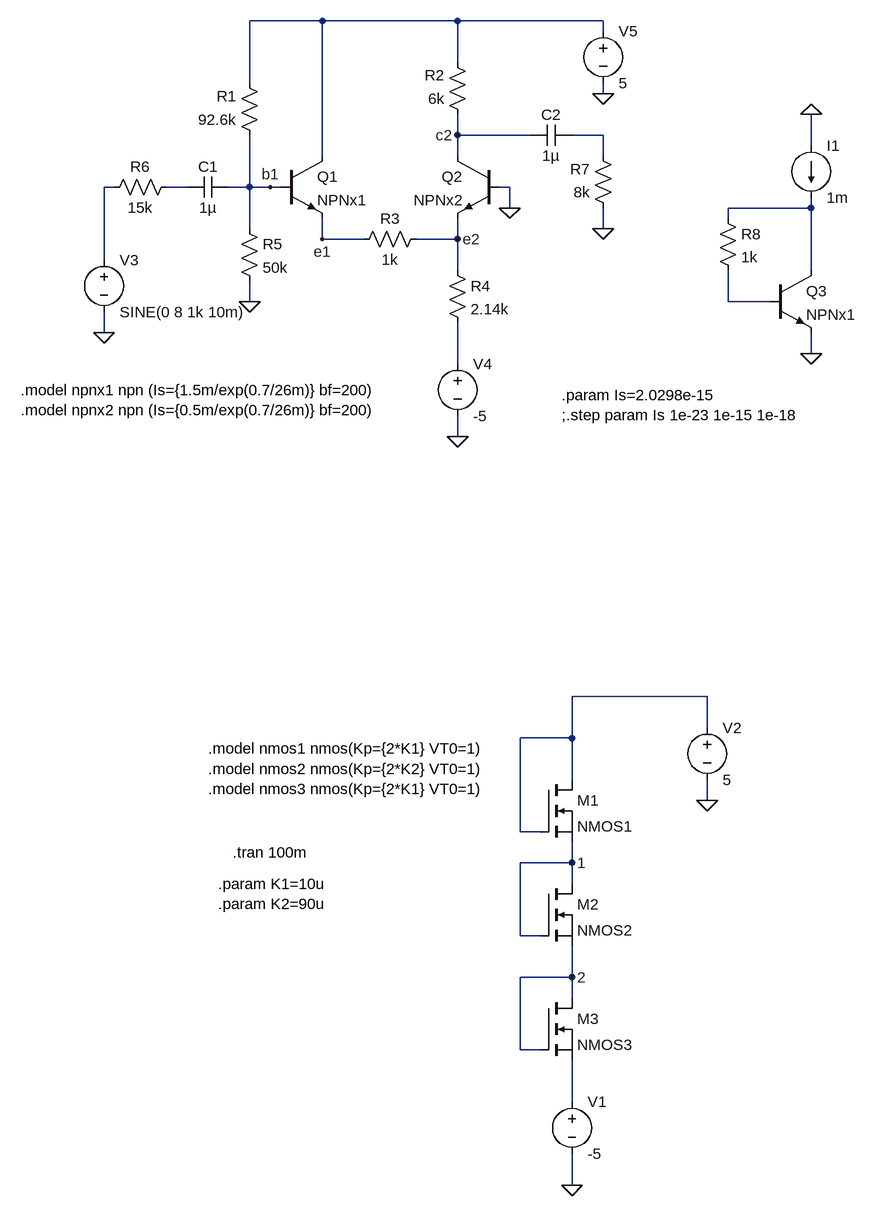
[diagram p0: schematic ss08.asc]
ss08.asc, the LTspice schematic file:
Version 4
SHEET 1 1564 680
WIRE 640 -1168 528 -1168
WIRE 848 -1168 640 -1168
WIRE 1072 -1168 848 -1168
WIRE 1072 -1152 1072 -1168
WIRE 848 -1104 848 -1168
WIRE 528 -1072 528 -1168
WIRE 1072 -1056 1072 -1072
WIRE 848 -992 848 -1024
WIRE 960 -992 848 -992
WIRE 1072 -992 1024 -992
WIRE 1392 -976 1392 -1024
WIRE 640 -960 640 -1168
WIRE 848 -960 848 -992
WIRE 1072 -960 1072 -992
WIRE 320 -912 304 -912
WIRE 432 -912 400 -912
WIRE 528 -912 528 -992
WIRE 528 -912 496 -912
WIRE 560 -912 528 -912
WIRE 576 -912 560 -912
WIRE 928 -912 912 -912
WIRE 928 -880 928 -912
WIRE 1392 -880 1392 -896
WIRE 1392 -880 1264 -880
WIRE 1264 -864 1264 -880
WIRE 528 -848 528 -912
WIRE 1072 -848 1072 -880
WIRE 640 -832 640 -864
WIRE 704 -832 640 -832
WIRE 848 -832 848 -864
WIRE 848 -832 784 -832
WIRE 304 -800 304 -912
WIRE 848 -784 848 -832
WIRE 1392 -784 1392 -880
WIRE 528 -736 528 -768
WIRE 1264 -736 1264 -784
WIRE 1328 -736 1264 -736
WIRE 304 -688 304 -720
WIRE 1392 -656 1392 -688
WIRE 848 -640 848 -704
WIRE 848 -528 848 -560
WIRE 1232 -128 1024 -128
WIRE 1232 -80 1232 -128
WIRE 1024 -64 1024 -128
WIRE 1024 -64 944 -64
WIRE 1024 0 1024 -64
WIRE 1232 32 1232 0
WIRE 944 80 944 -64
WIRE 976 80 944 80
WIRE 1024 128 1024 96
WIRE 1024 128 944 128
WIRE 1024 160 1024 128
WIRE 944 240 944 128
WIRE 976 240 944 240
WIRE 1024 304 1024 256
WIRE 1024 304 944 304
WIRE 1024 336 1024 304
WIRE 944 416 944 304
WIRE 976 416 944 416
WIRE 1024 496 1024 432
WIRE 1024 624 1024 576
FLAG 1024 624 0
FLAG 1232 32 0
FLAG 1024 128 1
FLAG 1024 304 2
FLAG 304 -688 0
FLAG 1072 -848 0
FLAG 528 -736 0
FLAG 848 -528 0
FLAG 1072 -1056 0
FLAG 928 -880 0
FLAG 1392 -656 0
FLAG 1392 -1024 0
FLAG 848 -992 c2
FLAG 640 -832 e1
FLAG 848 -832 e2
FLAG 560 -912 b1
SYMBOL nmos 976 0 R0
SYMATTR InstName M1
SYMATTR Value NMOS1
SYMBOL nmos 976 160 R0
SYMATTR InstName M2
SYMATTR Value NMOS2
SYMBOL nmos 976 336 R0
SYMATTR InstName M3
SYMATTR Value NMOS3
SYMBOL voltage 1024 480 R0
WINDOW 123 0 0 Left 2
WINDOW 39 0 0 Left 2
SYMATTR InstName V1
SYMATTR Value -5
SYMBOL voltage 1232 -96 R0
WINDOW 123 0 0 Left 2
WINDOW 39 0 0 Left 2
SYMATTR InstName V2
SYMATTR Value 5
SYMBOL voltage 304 -816 R0
WINDOW 123 0 0 Left 2
WINDOW 39 0 0 Left 2
SYMATTR InstName V3
SYMATTR Value SINE(0 8 1k 10m)
SYMBOL res 544 -976 R180
WINDOW 0 36 76 Left 2
WINDOW 3 36 40 Left 2
SYMATTR InstName R1
SYMATTR Value 92.6k
SYMBOL res 864 -1008 R180
WINDOW 0 36 76 Left 2
WINDOW 3 36 40 Left 2
SYMATTR InstName R2
SYMATTR Value 6k
SYMBOL res 688 -816 R270
WINDOW 0 32 56 VTop 2
WINDOW 3 0 56 VBottom 2
SYMATTR InstName R3
SYMATTR Value 1k
SYMBOL res 832 -800 R0
SYMATTR InstName R4
SYMATTR Value 2.14k
SYMBOL res 512 -864 R0
SYMATTR InstName R5
SYMATTR Value 50k
SYMBOL res 416 -928 R90
WINDOW 0 0 56 VBottom 2
WINDOW 3 32 56 VTop 2
SYMATTR InstName R6
SYMATTR Value 15k
SYMBOL res 1088 -864 R180
WINDOW 0 36 76 Left 2
WINDOW 3 36 40 Left 2
SYMATTR InstName R7
SYMATTR Value 8k
SYMBOL cap 1024 -1008 R90
WINDOW 0 0 32 VBottom 2
WINDOW 3 32 32 VTop 2
SYMATTR InstName C2
SYMATTR Value 1µ
SYMBOL npn 576 -960 R0
SYMATTR InstName Q1
SYMATTR Value NPNx1
SYMBOL npn 912 -960 M0
SYMATTR InstName Q2
SYMATTR Value NPNx2
SYMBOL voltage 848 -656 R0
WINDOW 123 0 0 Left 2
WINDOW 39 0 0 Left 2
SYMATTR InstName V4
SYMATTR Value -5
SYMBOL voltage 1072 -1168 R0
WINDOW 123 0 0 Left 2
WINDOW 39 0 0 Left 2
SYMATTR InstName V5
SYMATTR Value 5
SYMBOL npn 1328 -784 R0
SYMATTR InstName Q3
SYMATTR Value NPNx1
SYMBOL current 1392 -976 R0
SYMATTR InstName I1
SYMATTR Value 1m
SYMBOL res 1248 -880 R0
SYMATTR InstName R8
SYMATTR Value 1k
SYMBOL cap 496 -928 R90
WINDOW 0 0 32 VBottom 2
WINDOW 3 32 32 VTop 2
SYMATTR InstName C1
SYMATTR Value 1µ
TEXT 464 -48 Left 2 !.model nmos1 nmos(Kp={2*K1} VT0=1)\n.model nmos2 nmos(Kp={2*K2} VT0=1)\n.model nmos3 nmos(Kp={2*K1} VT0=1)
TEXT 502 112 Left 2 !.tran 100m
TEXT 480 160 Left 2 !.param K1=10u\n.param K2=90u
TEXT 176 -600 Left 2 !.model npnx1 npn (Is={1.5m/exp(0.7/26m)} bf=200)\n.model npnx2 npn (Is={0.5m/exp(0.7/26m)} bf=200)
TEXT 1008 -592 Left 2 !.param Is=2.0298e-15\n;.step param Is 1e-23 1e-15 1e-18

The netlist it stands for:
* ss08.asc
M1 N008 N008 1 1 NMOS1
M2 1 1 2 2 NMOS2
M3 2 2 N009 N009 NMOS3
V1 N009 0 -5
V2 N008 0 5
V3 N003 0 SINE(0 8 1k 10m)
R1 b1 N001 92.6k
R2 c2 N001 6k
R3 e1 e2 1k
R4 e2 N007 2.14k
R5 b1 0 50k
R6 N004 N003 15k
R7 0 N002 8k
C2 N002 c2 1µ
Q1 N001 b1 e1 0 NPNx1
Q2 c2 0 e2 0 NPNx2
V4 N007 0 -5
V5 N001 0 5
Q3 N005 N006 0 0 NPNx1
I1 0 N005 1m
R8 N005 N006 1k
C1 b1 N004 1µ
.model NPN NPN
.model PNP PNP
.lib standard.bjt
.model NMOS NMOS
.model PMOS PMOS
.lib standard.mos
.model nmos1 nmos(Kp={2*K1} VT0=1)
.model nmos2 nmos(Kp={2*K2} VT0=1)
.model nmos3 nmos(Kp={2*K1} VT0=1)
.tran 100m
.param K1=10u
.param K2=90u
.model npnx1 npn (Is={1.5m/exp(0.7/26m)} bf=200)
.model npnx2 npn (Is={0.5m/exp(0.7/26m)} bf=200)
.param Is=2.0298e-15
;.step param Is 1e-23 1e-15 1e-18
.backanno
.end